# EasyEDA Pro project X-ROBOT主控板2.eprj

# Schematic Schematic1
Board Name: Board1; Create Date: 2024-06-28; Page Name: P1; Project Name: X-ROBOT主控板2; Schematic Name: Schematic1; Update Date: 2024-10-14
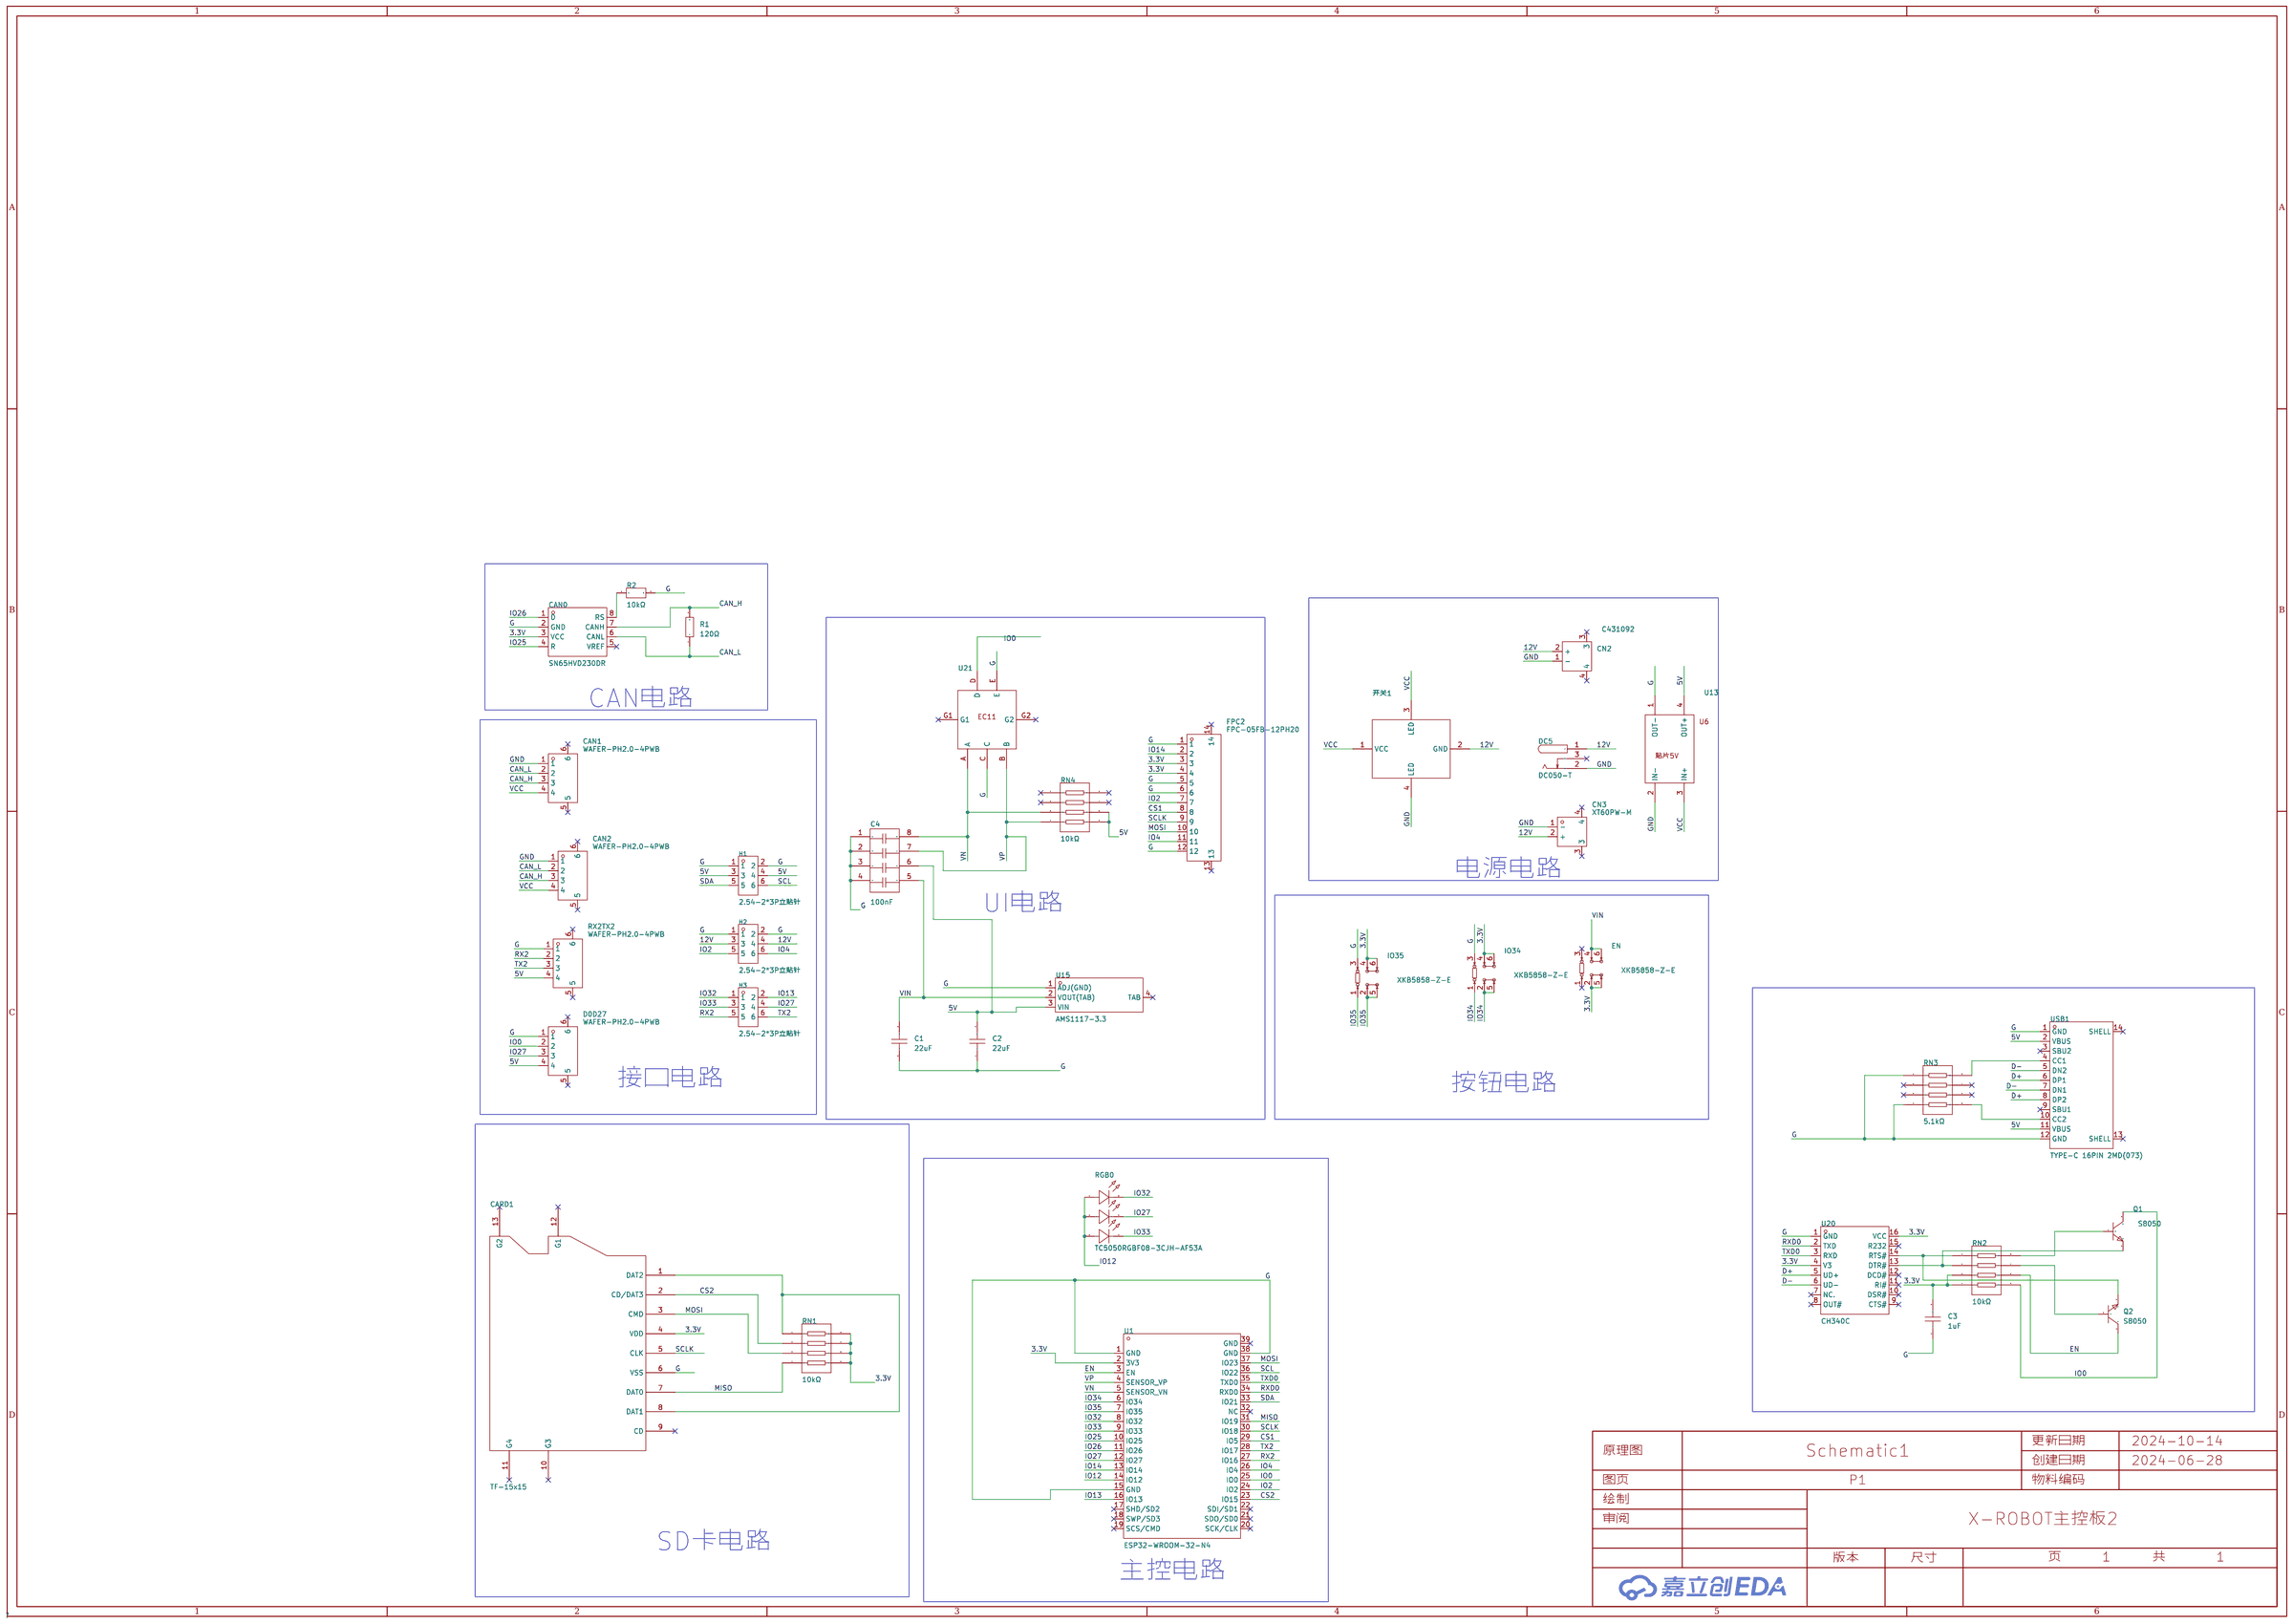
[diagram p0: schematic sheet]

## Parts
C1  22uF  [C0805]
C2  22uF  [C0805]
C3  1uF  [C0603]
C4  100nF  [CAP-ARRAY-SMD_6124-8P-L1.6-W3.2-BL]
CAN0  SN65HVD230DR  [SOIC-8_L4.9-W3.9-P1.27-LS6.0-BL]
CAN1  WAFER-PH2.0-4PWB  [CONN-SMD_4P-P2.00_XUNPU_WAFER-PH2.0-4PWB]
CAN2  WAFER-PH2.0-4PWB  [CONN-SMD_4P-P2.00_XUNPU_WAFER-PH2.0-4PWB]
CARD1  TF-15x15  [TF-SMD_TF-15-15]
CN2  C431092  [CONN-TH_XT30PW-M]
CN3  XT60PW-M  [CONN-TH_XT60PW-M]
D0D27  WAFER-PH2.0-4PWB  [CONN-SMD_4P-P2.00_XUNPU_WAFER-PH2.0-4PWB]
DC5  DC050-T  [DC-IN_DC050-T]
EN  XKB5858-Z-E  [SW-TH_XKB5858-Z-E]
FPC2  FPC-05FB-12PH20  [FPC-SMD_12P-P0.50_XUNPU_FPC-05FB-12PH20]
H1  2.54-2*3P立贴针  [HDR-SMD_6P-P2.54-V-M-R2-C5-S7.4]
H2  2.54-2*3P立贴针  [HDR-SMD_6P-P2.54-V-M-R2-C5-S7.4]
H3  2.54-2*3P立贴针  [HDR-SMD_6P-P2.54-V-M-R2-C5-S7.4]
IO34  XKB5858-Z-E  [SW-TH_XKB5858-Z-E]
IO35  XKB5858-Z-E  [SW-TH_XKB5858-Z-E]
Q1  S8050  [SOT-23-3_L2.9-W1.3-P1.90-LS2.3-BR]
Q2  S8050  [SOT-23-3_L2.9-W1.3-P1.90-LS2.3-BR]
R1  120Ω  [R0603]
R2  10kΩ  [R0603]
RGB0  TC5050RGBF08-3CJH-AF53A  [LED-SMD_6P-L5.0-W5.0-TL_TC5050RGBF08]
RN1  10kΩ  [RES-ARRAY-SMD_0603-8P-L3.2-W1.6-BL]
RN2  10kΩ  [RES-ARRAY-SMD_0603-8P-L3.2-W1.6-BL]
RN3  5.1kΩ  [RES-ARRAY-SMD_0603-8P-L3.2-W1.6-BL]
RN4  10kΩ  [RES-ARRAY-SMD_0603-8P-L3.2-W1.6-BL]
RX2TX2  WAFER-PH2.0-4PWB  [CONN-SMD_4P-P2.00_XUNPU_WAFER-PH2.0-4PWB]
U1  ESP32-WROOM-32-N4  [WIFIM-SMD_ESP32-WROOM-32-N4]
U13  -  [降压模块贴片]
U15  AMS1117-3.3  [SOT-223-4_L6.5-W3.5-P2.30-LS7.0-BR]
U20  CH340C  [SOP-16_L10.0-W3.9-P1.27-LS6.0-BL]
U21  -  [EC11-SMT]
USB1  TYPE-C 16PIN 2MD(073)  [USB-C-SMD_TYPE-C-6PIN-2MD-073]
开关1  -  [灯开关]

## Library data of the parts
C1 C2 = CGA0805X5R226M350MT: 容值:22uF;精度:±20%;额定电压:35V;材质(温度系数):X5R;; LCSC Part Name: 22uF ±20% 35V; Supplier Part: C6119901; Manufacturer: HRE(芯声); Supplier Footprint: 0805; JLCPCB Part Class: 扩展库; Datasheet: https://atta.szlcsc.com/upload/public/pdf/source/20231129/D589D0CC4D260F7AC3A77E53B455CCB3.pdf; Supplier: LCSC; Tolerance: ±20%; Voltage Rated: 35V; Temperature Coefficient: X5R
C3 = CL10A105KB8NNNC: 容值:1uF;精度:±10%;额定电压:50V;材质(温度系数):X5R;; LCSC Part Name: 1uF ±10% 50V; Supplier Part: C15849; Manufacturer: SAMSUNG(三星); Supplier Footprint: 0603; JLCPCB Part Class: 基础库; Datasheet: https://atta.szlcsc.com/upload/public/pdf/source/20160218/1457707763339.pdf; Supplier: LCSC; Tolerance: ±10%; Voltage Rated: 50V; Temperature Coefficient: X5R
C4 = 6124B104K500NT: 容值:100nF;精度:±10%;额定电压:50V;温度系数:X7R;电路形式:独立;; LCSC Part Name: 100nFX4 ±10% 50V; Supplier Part: C62857; Manufacturer: FH(风华); Supplier Footprint: 0612; JLCPCB Part Class: 扩展库; Datasheet: https://atta.szlcsc.com/upload/public/pdf/source/20230210/910F532CDA9A4E3A43AC22A06F0B1EDD.pdf; Supplier: LCSC; Tolerance: ±10%; Rated Voltage: 50V; Temperature Coefficient: X7R; Number of Capacitors: 4; Circuit Type: 独立
CAN0 = SN65HVD230DR: 类型:收发器;协议类别:CAN总线;数据速率:1Mbps;; Supplier Part: C12084; Manufacturer: TI(德州仪器); Supplier Footprint: SOIC-8_150mil; JLCPCB Part Class: Basic Part; Datasheet: https://atta.szlcsc.com/upload/public/pdf/source/20140508/1457707055452.pdf; Supplier: LCSC; Type: 收发器; Protocol: CAN总线; Data Rate: 1Mbps; Supply Voltage: 3V ~ 3.6V
CAN1 CAN2 D0D27 RX2TX2 = WAFER-PH2.0-4PWB: 插针结构:1x4P;间距:2mm;安装方式:卧贴;总PIN数:4P;排数:1;每排PIN数:4;额定电流:2A;工作温度范围:-25℃~+85℃;; LCSC Part Name: 1x4P 间距:2mm 卧贴; Supplier Part: C3029442; Manufacturer: XUNPU(讯普); Supplier Footprint: SMD,P=2mm,卧贴; JLCPCB Part Class: 扩展库; Datasheet: https://atta.szlcsc.com/upload/public/pdf/source/20220527/83903C18429EFE4C9EEE8C529A248431.pdf; Supplier: LCSC; Pins Structure: 1x4P; Pitch: 2mm; Mounting Style: 卧贴; Number of Pins: 4P; Number of Rows: 1; Number of PINs Per Row: 4; Current Rating (Max): 2A; Operating Temperature Range: -25℃~+85℃
CARD1 = TF-15x15: 卡连接方式:自弹式;卡类型:MicroSD卡(TF卡);连接器类型:卡座;本体最大高度:-;触头材质:-;触头镀层:-;工作温度范围:-;焊接温度(最大值):-;; LCSC Part Name: 自弹式 MicroSD卡(TF卡) 卡座; Supplier Part: C111196; Manufacturer: SOFNG(硕方); Supplier Footprint: SMD; JLCPCB Part Class: 扩展库; Datasheet: https://atta.szlcsc.com/upload/public/pdf/source/20200911/C111196_6985EA70490FD8F56A5C3F4D017F3786.pdf; Supplier: LCSC; Card Connection Mode: 自弹式; Card Type: MicroSD卡(TF卡); Connector Type: 卡座
CN2 = XT30PW-M: Socket,DCsupply,XT30,male,PIN:2; LCSC Part Name: XT30PW-M公头; Manufacturer: AMASS(艾迈斯); Supplier Footprint: Through Hole; JLCPCB Part Class: Extended Part; Datasheet: https://atta.szlcsc.com/upload/public/pdf/source/20220222/6A9F22F7850E25B33E1BE430ADF8560B.pdf; Supplier: LCSC
CN3 = XT60PW-M: 类别:-;类型1:-;; LCSC Part Name: AMASS(艾迈斯)航模插头xt60连接器150公母对接pw锂电池公头 板插卧式XT60PW-M; Supplier Part: C98732; Manufacturer: AMASS(艾迈斯); JLCPCB Part Class: 扩展库; Datasheet: https://atta.szlcsc.com/upload/public/pdf/source/20240118/44A3DCFF53BE25DC65378AFFB21277A4.pdf; Supplier: LCSC; Brand: 艾迈斯; Type: 卧式插头; Colour: 黄色; InterfaceType: 公头
DC5 = DC050-T: 连接器类型:DC电源插座;安装方式:卧贴;触点内径:2mm;触点外径:6.4mm;额定电流:4A;额定电压:16V;触头材质:-;触头镀层:-;工作温度范围:-;焊接温度(最大值):-;; LCSC Part Name: DC电源插座 内径:2mm 外径:6.4mm; Supplier Part: C431534; Manufacturer: SHOU HAN(首韩); Supplier Footprint: SMD; JLCPCB Part Class: 扩展库; Datasheet: https://atta.szlcsc.com/upload/public/pdf/source/20190925/C431534_67EA3B20454E00D5CD394807B04C56FF.pdf; Supplier: LCSC; Connector Type: DC电源插座; Mounting Style: 卧贴; Inside Contact Diameter: 2mm; Outside Contact Diameter: 6.4mm; Current Rating (Max): 4A; Voltage Rating (Max): 16V
EN IO34 IO35 = XKB5858-Z-E: 自锁/无锁:自锁;安装方式:卧插;触点电流:100mA;额定电压 (AC):250V;额定电压 (DC):30V;带灯:不带;作用力:2.5N;机械寿命:10万次;; Supplier Part: C780038; Manufacturer: XKB Connection(中国星坤); Supplier Footprint: 插件; JLCPCB Part Class: 扩展库; Datasheet: https://atta.szlcsc.com/upload/public/pdf/source/20211011/56D3FA9FC185EAC41365C3B37B684CC1.pdf; Supplier: LCSC; Self Lock / No Lock: 自锁; Actuator Style: 方形按钮; Mounting Style: 卧插; Contact Current: 100mA; Voltage Rating (AC): 250V; Voltage Rating (DC): 30V; Insulation Resistance: 100MΩ; Actuator/Cap Color: 白色; With Lamp: 不带; Pin Style: PC引脚; Operating Force: 2.5N; Operating Temperature: -15℃~+55℃; Mechanical Life: 10万次
FPC2 = FPC-05FB-12PH20: 锁定特性:翻盖式;触点类型:双侧触点/上下接;触点数量:12P;间距:0.5mm;安装类型:卧贴;工作温度范围:-25℃~+85℃;; LCSC Part Name: 间距:0.5mm P数:12P 翻盖式 双侧触点/上下接; Supplier Part: C2856829; Manufacturer: XUNPU(讯普); Supplier Footprint: SMD,P=0.5mm,卧贴; JLCPCB Part Class: 扩展库; Datasheet: https://atta.szlcsc.com/upload/public/pdf/source/20210922/C2856829_1461FF4D7B8CBFF1BCF0CE5DE3B804A8.pdf; Supplier: LCSC; Locking Feature: 翻盖式; Contact Type: 双侧触点/上下接; Number of Contacts: 12P; Pitch: 0.5mm; Mounting Type: 卧贴; FFC, FCB Thickness: 0.3mm; Height Above Board: 2mm; Operating Temperature Range: -25℃~+85℃
H1-H3 = 2.54-2*3P立贴针: 插针结构:-;间距:2.54mm;行距:-;圆针/方针:-;安装类型:-;排数:双排;总PIN位数:6P;额定电流:-;额定电压:-;配合针长度:-;塑高:-;触头材质:-;触头镀层:-;颜色:黑色;; LCSC Part Name: 间距:2.54mm; Supplier Part: C192301; Manufacturer: BOOMELE(博穆精密); Supplier Footprint: SMD,P=2.54mm,卧贴; JLCPCB Part Class: 扩展库; Supplier: LCSC; Pitch: 2.54mm; Number of Rows: 双排; Number of Pins: 6P; Color: 黑色
Q1 Q2 = S8050_C20069125: 晶体管类型:NPN;集电极电流(Ic):500mA;集射极击穿电压(Vceo):25V;功率(Pd):300mW;直流电流增益(hFE@Ic,Vce):120@50mA,1.0V;; LCSC Part Name: NPN 电流:500mA 耐压:25V; Supplier Part: C20069125; Manufacturer: 宏迦橙; Supplier Footprint: SOT-23; JLCPCB Part Class: 扩展库; Datasheet: https://atta.szlcsc.com/upload/public/pdf/source/20240403/2D78449C96B6E27F13BF8BDF79E27159.pdf; Supplier: LCSC; Transistor Type: NPN; Collector Current (Ic): 500mA; Collector-Emitter Breakdown Voltage (Vceo): 25V; Power Dissipation (Pd): 300mW; DC Current Gain (hFE@Ic,Vce): 120@50mA,1.0V; Transition Frequency (fT): 100MHz; Collector Cut-Off Current (Icbo): 100nA; Collector-Emitter Saturation Voltage (VCE(sat)@Ic,Ib): 600mV@500mA,50mA; Operating Temperature: -55℃~+150℃
R1 = 0603WAF1200T5E: 电阻类型:厚膜电阻;阻值:120Ω;精度:±1%;功率:100mW;最大工作电压:75V;温度系数:±100ppm/℃;; LCSC Part Name: 120Ω ±1% 100mW 厚膜电阻; Supplier Part: C22787; Manufacturer: UNI-ROYAL(厚声); Supplier Footprint: 0603; JLCPCB Part Class: 基础库; Datasheet: https://atta.szlcsc.com/upload/public/pdf/source/20200306/C422600_1E6D84923E4A46A82E41ADD87F860B5C.pdf; Supplier: LCSC; Type: 厚膜电阻; Tolerance: ±1%; Power(Watts): 100mW; Overload Voltage (Max): 75V; Temperature Coefficient: ±100ppm/℃; Operating Temperature Range: -55℃~+155℃
R2 = FRC0603J103TS: 电阻类型:厚膜电阻;阻值:10kΩ;精度:±5%;功率:100mW;最大工作电压:75V;温度系数:±100ppm/℃;; LCSC Part Name: 10kΩ ±5% 100mW 厚膜电阻; Supplier Part: C2930027; Manufacturer: FOJAN(富捷); Supplier Footprint: 0603; JLCPCB Part Class: 扩展库; Datasheet: https://atta.szlcsc.com/upload/public/pdf/source/20211221/925EC7D7225764EE0046F22065062C87.pdf; Supplier: LCSC; Type: 厚膜电阻; Tolerance: ±5%; Power(Watts): 100mW; Overload Voltage (Max): 75V; Temperature Coefficient: ±100ppm/℃; Operating Temperature Range: -55℃~+155℃
RGB0 = TC5050RGBF08-3CJH-AF53A: LED贴片5050RGB灯珠高亮红绿蓝三色0.2W; LCSC Part Name: RGB三色; Supplier Part: C784540; Manufacturer: TCWIN(天成); Supplier Footprint: SMD5050; JLCPCB Part Class: 扩展库; Datasheet: https://atta.szlcsc.com/upload/public/pdf/source/20230731/34B1F7048EB892D234C2083EEE9FB085.pdf; Supplier: LCSC
RN1 RN2 RN4 = 4D03WGJ0103T5E: 电阻器数:4;阻值:10kΩ;精度:±5%;单个元件功率:62.5mW;温度系数:±200ppm/℃;; LCSC Part Name: 10kΩ ±5%; Supplier Part: C29718; Manufacturer: UNI-ROYAL(厚声); Supplier Footprint: 0603x4; JLCPCB Part Class: 基础库; Datasheet: https://atta.szlcsc.com/upload/public/pdf/source/20191224/C474318_2527498AE30E813171187CCD28401A71.pdf; Supplier: LCSC; Number of Resistors: 4; Tolerance: ±5%; Power(Watts): 62.5mW; Temperature Coefficient: ±200ppm/℃; Number of Pins: 8
RN3 = 4D03WGJ0512T5E: 电阻器数:4;阻值:5.1kΩ;精度:±5%;单个元件功率:62.5mW;温度系数:±200ppm/℃;; LCSC Part Name: 5.1kΩ ±5% 0603x4; Supplier Part: C12028; Manufacturer: UNI-ROYAL(厚声); Supplier Footprint: 0603x4; JLCPCB Part Class: 扩展库; Datasheet: https://atta.szlcsc.com/upload/public/pdf/source/20191224/C474318_2527498AE30E813171187CCD28401A71.pdf; Supplier: LCSC; Number of Resistors: 4; Tolerance: ±5%; Power(Watts): 62.5mW; Temperature Coefficient: ±200ppm/℃; Number of Pins: 8
U1 = ESP32-WROOM-32-N4: WiFi+蓝牙4.2+双核CPU,ESP32; LCSC Part Name: WiFi+蓝牙4.2+双核CPU模块; Supplier Part: C82899; Manufacturer: ESPRESSIF(乐鑫); Supplier Footprint: SMD,18x25.5mm; JLCPCB Part Class: 扩展库; Datasheet: https://atta.szlcsc.com/upload/public/pdf/source/20210719/C82899_2D52724B6FAFABC419BCF308C5944296.pdf; Supplier: LCSC
U13 = 降压模块贴片
U15 = AMS1117-3.3_C347222: 输出类型:固定;最大输入电压:12V;输出电压:3.3V;最大输出电流:1A;电源纹波抑制比(PSRR):60dB@(120Hz);输出极性:正极;; LCSC Part Name: 输出:3.3V 电流:1A 耐压:12V; Supplier Part: C347222; Manufacturer: UMW(友台半导体); Supplier Footprint: SOT-223; JLCPCB Part Class: 扩展库; Datasheet: https://atta.szlcsc.com/upload/public/pdf/source/20231109/155D79A26D9DB04352555A58D5969DC8.pdf; Supplier: LCSC; Output Type: 固定; Maximum Input Voltage: 12V; Output Voltage: 3.3V; MAX Output Current: 1A; Power Supply Rejection Ratio (PSRR): 60dB@(120Hz); Dropout Voltage: 1.3V@(1A); Output Polarity: 正极; Number of Outputs: 1
U20 = CH340C_C7464026: LCSC Part Name: CH340C （SMT编带）人工转编带; Supplier Part: C7464026; Manufacturer: WCH(南京沁恒); Supplier Footprint: SOP-16; JLCPCB Part Class: 扩展库; Datasheet: https://atta.szlcsc.com/upload/public/pdf/source/20230530/6E401E9554E9F5311886CC8B3F89B62E.pdf; Supplier: LCSC
U21 = EC11-SMT
USB1 = TYPE-C 16PIN 2MD(073): 连接器类型:Type-C;标准:-;公母:母;端口数量:1;触点数量:16P;安装方式:卧贴;额定电流 - 电源:5A;工作温度范围:-25℃~+85℃;; LCSC Part Name: Type-C 母 卧贴; Supplier Part: C2765186; Manufacturer: SHOU HAN(首韩); Supplier Footprint: SMD; JLCPCB Part Class: 扩展库; Datasheet: https://atta.szlcsc.com/upload/public/pdf/source/20211123/39B17C16241EAC15C5E277BDA434118E.pdf; Supplier: LCSC; Connector Type: Type-C; Gender: 母; Number of Ports: 1; Number of Contacts: 16P; Mounting Style: 卧贴; Current Rating - Power (Max): 5A; Operating Temperature Range: -25℃~+85℃
开关1 = 灯开关

## Nets
3.3V: C3.2 CAN0.3(VCC) CARD1.4(VDD) EN.2 EN.5 FPC2.3 FPC2.4 IO34.4 IO34.6 IO35.4 IO35.6 RN1.5 RN1.6 RN1.7 RN1.8 RN2.3 RN2.4 U1.2(3V3) U20.4(V3) U20.16(VCC)
5V: C2.2 C4.6 D0D27.4 H1.3 H1.4 RN4.5 RN4.6 RX2TX2.4 U13.4(OUT+) U15.3(VIN) USB1.2(VBUS) USB1.11(VBUS)
12V: CN2.2(+) CN3.2(+) DC5.1 H2.3 H2.4 开关1.2(GND)
GND: CAN1.1 CAN2.1 CN2.1(-) CN3.1(-) DC5.2 U13.2(IN-) 开关1.4(LED)
VCC: CAN1.4 CAN2.4 U13.3(IN+) 开关1.1(VCC) 开关1.3(LED)
VIN: C1.2 C4.5 EN.4 EN.6 U15.2(VOUT(TAB))
CAN_H: CAN0.7(CANH) CAN1.3 CAN2.3 R1.2
CAN_L: CAN0.6(CANL) CAN1.2 CAN2.2 R1.1
CS1: FPC2.8 U1.29(IO5)
CS2: CARD1.2(CD/DAT3) RN1.2 U1.23(IO15)
D+: U20.5(UD+) USB1.6(DP1) USB1.8(DP2)
D-: U20.6(UD-) USB1.5(DN2) USB1.7(DN1)
EN: Q2.3(C) RN2.6 U1.3(EN)
G: C1.1 C2.1 C3.1 C4.1 C4.2 C4.3 C4.4 CAN0.2(GND) CARD1.6(VSS) D0D27.1 FPC2.1 FPC2.5 FPC2.6 FPC2.12 H1.1 H1.2 H2.1 H2.2 IO34.3 IO35.3 R2.2 RN3.1 RN3.4 RX2TX2.1 U1.1(GND) U1.15(GND) U1.38(GND) U13.1(OUT-) U15.1(ADJ(GND)) U20.1(GND) U21.C U21.E USB1.1(GND) USB1.12(GND)
IO0: D0D27.2 Q1.3(C) RN2.5 U1.25(IO0) U21.D
IO2: FPC2.7 H2.5 U1.24(IO2)
IO4: FPC2.11 H2.6 U1.26(IO4)
IO12: RGB0.1(+) RGB0.2(+) RGB0.3(+) U1.14(IO12)
IO13: H3.2 U1.16(IO13)
IO14: FPC2.2 U1.13(IO14)
IO25: CAN0.4(R) U1.10(IO25)
IO26: CAN0.1(D) U1.11(IO26)
IO27: D0D27.3 H3.4 RGB0.5(-) U1.12(IO27)
IO32: H3.1 RGB0.6(-) U1.8(IO32)
IO33: H3.3 RGB0.4(-) U1.9(IO33)
IO34: IO34.1 IO34.2 IO34.5 U1.6(IO34)
IO35: IO35.1 IO35.2 IO35.5 U1.7(IO35)
MISO: CARD1.7(DAT0) RN1.4 U1.31(IO19)
MOSI: CARD1.3(CMD) FPC2.10 RN1.3 U1.37(IO23)
RX2: H3.5 RX2TX2.2 U1.27(IO16)
RXD0: U1.34(RXD0) U20.2(TXD)
SCL: H1.6 U1.36(IO22)
SCLK: CARD1.5(CLK) FPC2.9 U1.30(IO18)
SDA: H1.5 U1.33(IO21)
TX2: H3.6 RX2TX2.3 U1.28(IO17)
TXD0: U1.35(TXD0) U20.3(RXD)
VN: C4.8 RN4.3 U1.5(SENSOR_VN) U21.A
VP: C4.7 RN4.4 U1.4(SENSOR_VP) U21.B
$1N183: CARD1.1(DAT2) CARD1.8(DAT1) RN1.1
$1N4998: Q1.2(E) RN2.2 U20.13(DTR#)
$1N5002: Q2.1(B) RN2.7
$1N5022: Q2.2(E) RN2.1 U20.14(RTS#)
$1N5027: Q1.1(B) RN2.8
$1N5307: RN3.5 USB1.10(CC2)
$1N5334: RN3.8 USB1.4(CC1)
$1N9575: CAN0.8(RS) R2.1

Not connected (* = marked no-connect by the designer): CAN0 5(VREF)*; CAN1 5* 6*; CAN2 5* 6*; CARD1 9(CD)* 10(G3)* 11(G4)* 12(G1)* 13(G2)*; CN2 3* 4*; CN3 3* 4*; D0D27 5* 6*; DC5 3*; EN 1* 3*; FPC2 13* 14*; RN3 2* 3* 6* 7*; RN4 1* 2* 7* 8*; RX2TX2 5* 6*; U1 17(SHD/SD2)* 18(SWP/SD3)* 19(SCS/CMD)* 20(SCK/CLK)* 21(SDO/SD0)* 22(SDI/SD1)* 32(NC)* 39(GND)*; U15 4(TAB)*; U20 7(NC.)* 8(OUT#)* 9(CTS#)* 10(DSR#)* 11(RI#)* 12(DCD#)* 15(R232)*; U21 G1* G2*; USB1 3(SBU2)* 9(SBU1)* 13(SHELL)* 14(SHELL)*

## Notes on the sheet
- CAN电路
- 电源电路
- UI电路
- 接口电路
- 按钮电路
- SD卡电路
- 主控电路

# Board PCB1
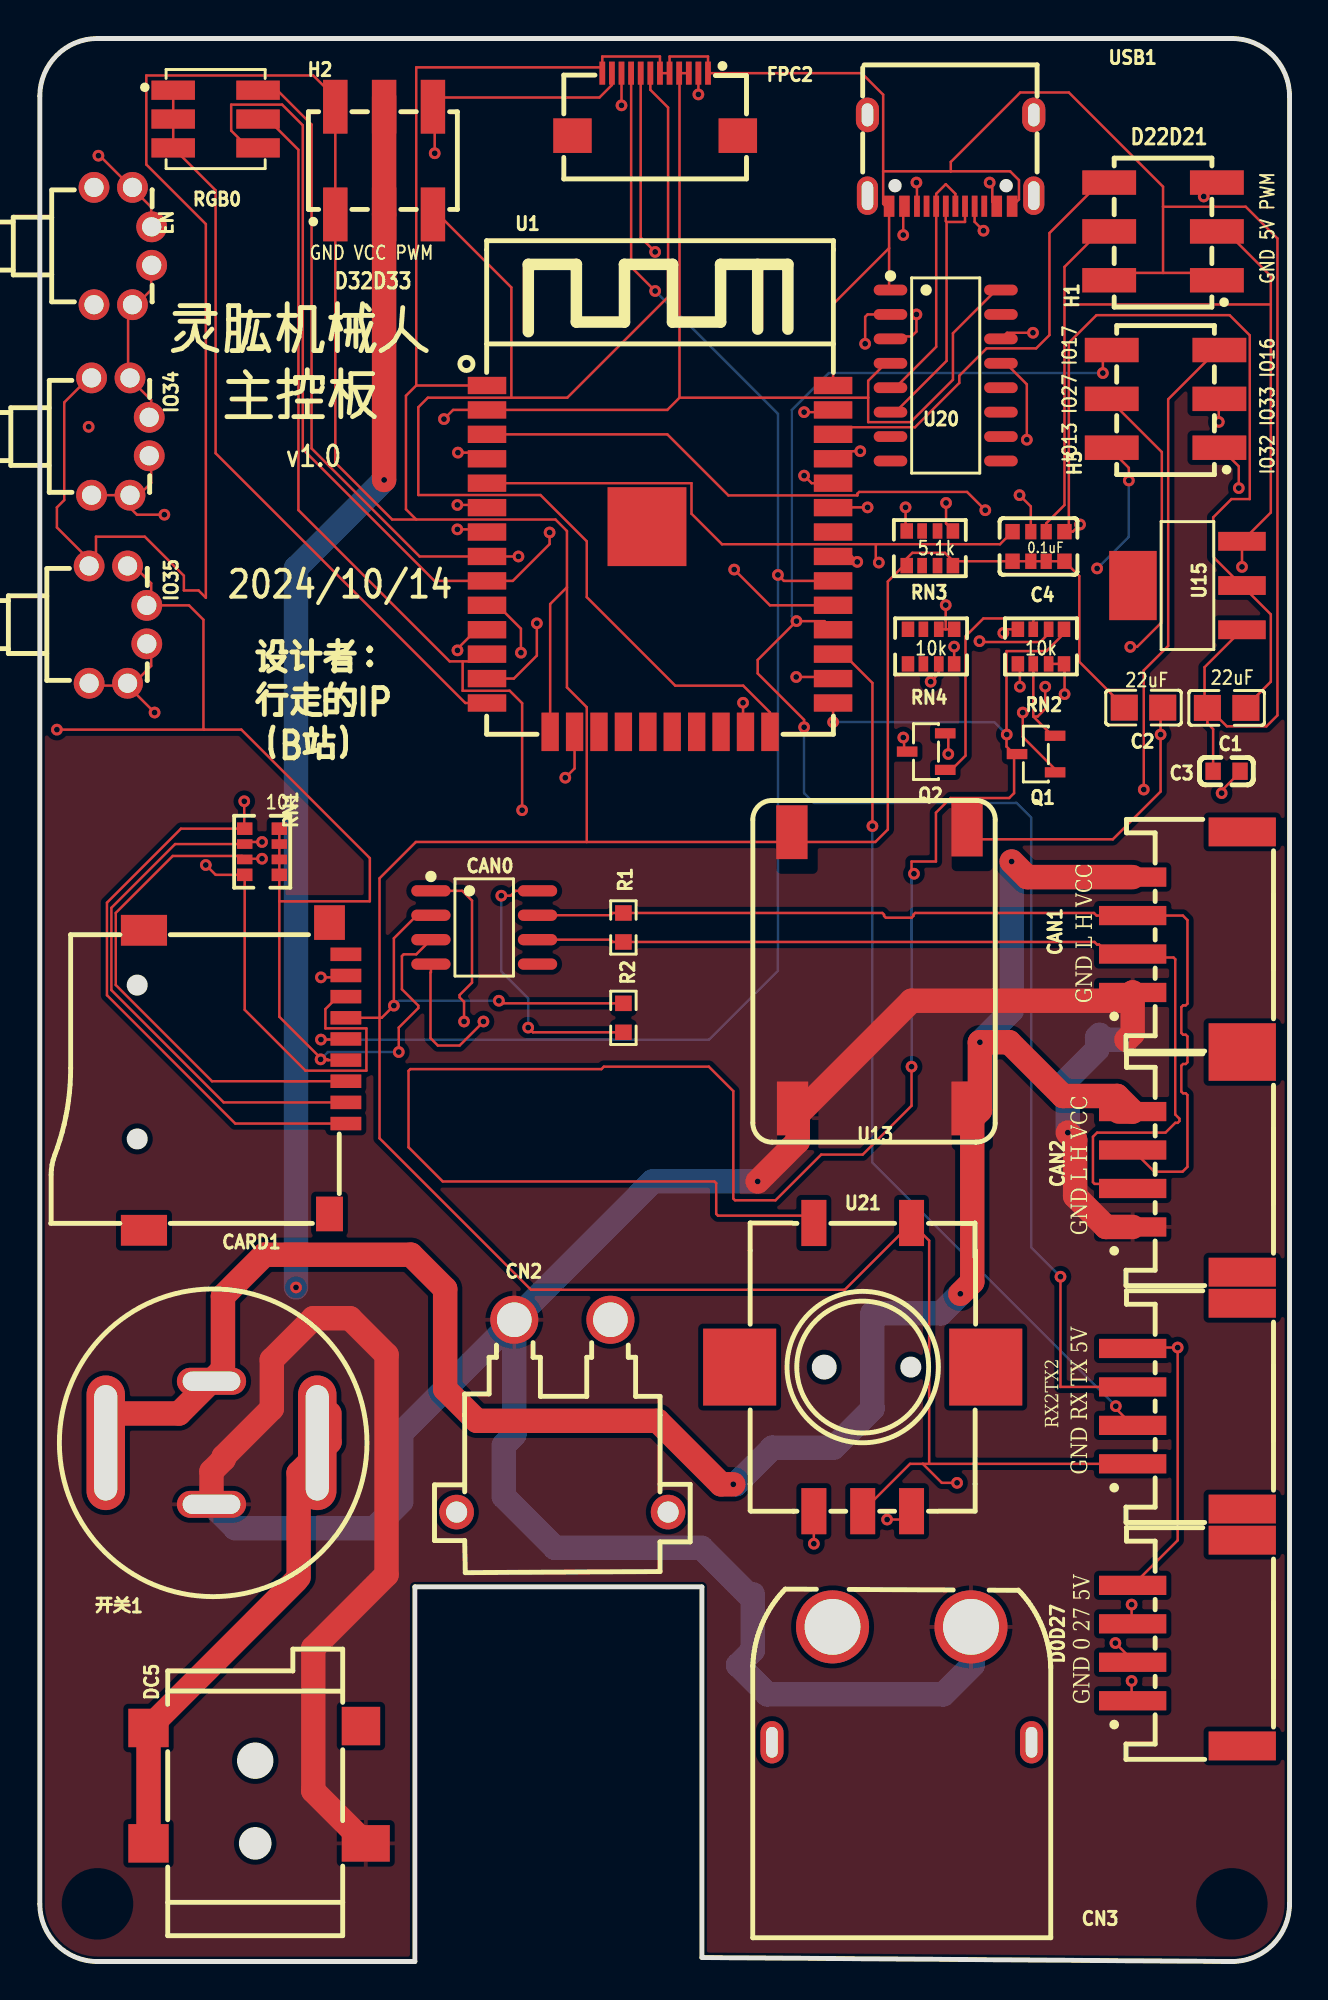
[diagram p1: board, top side]
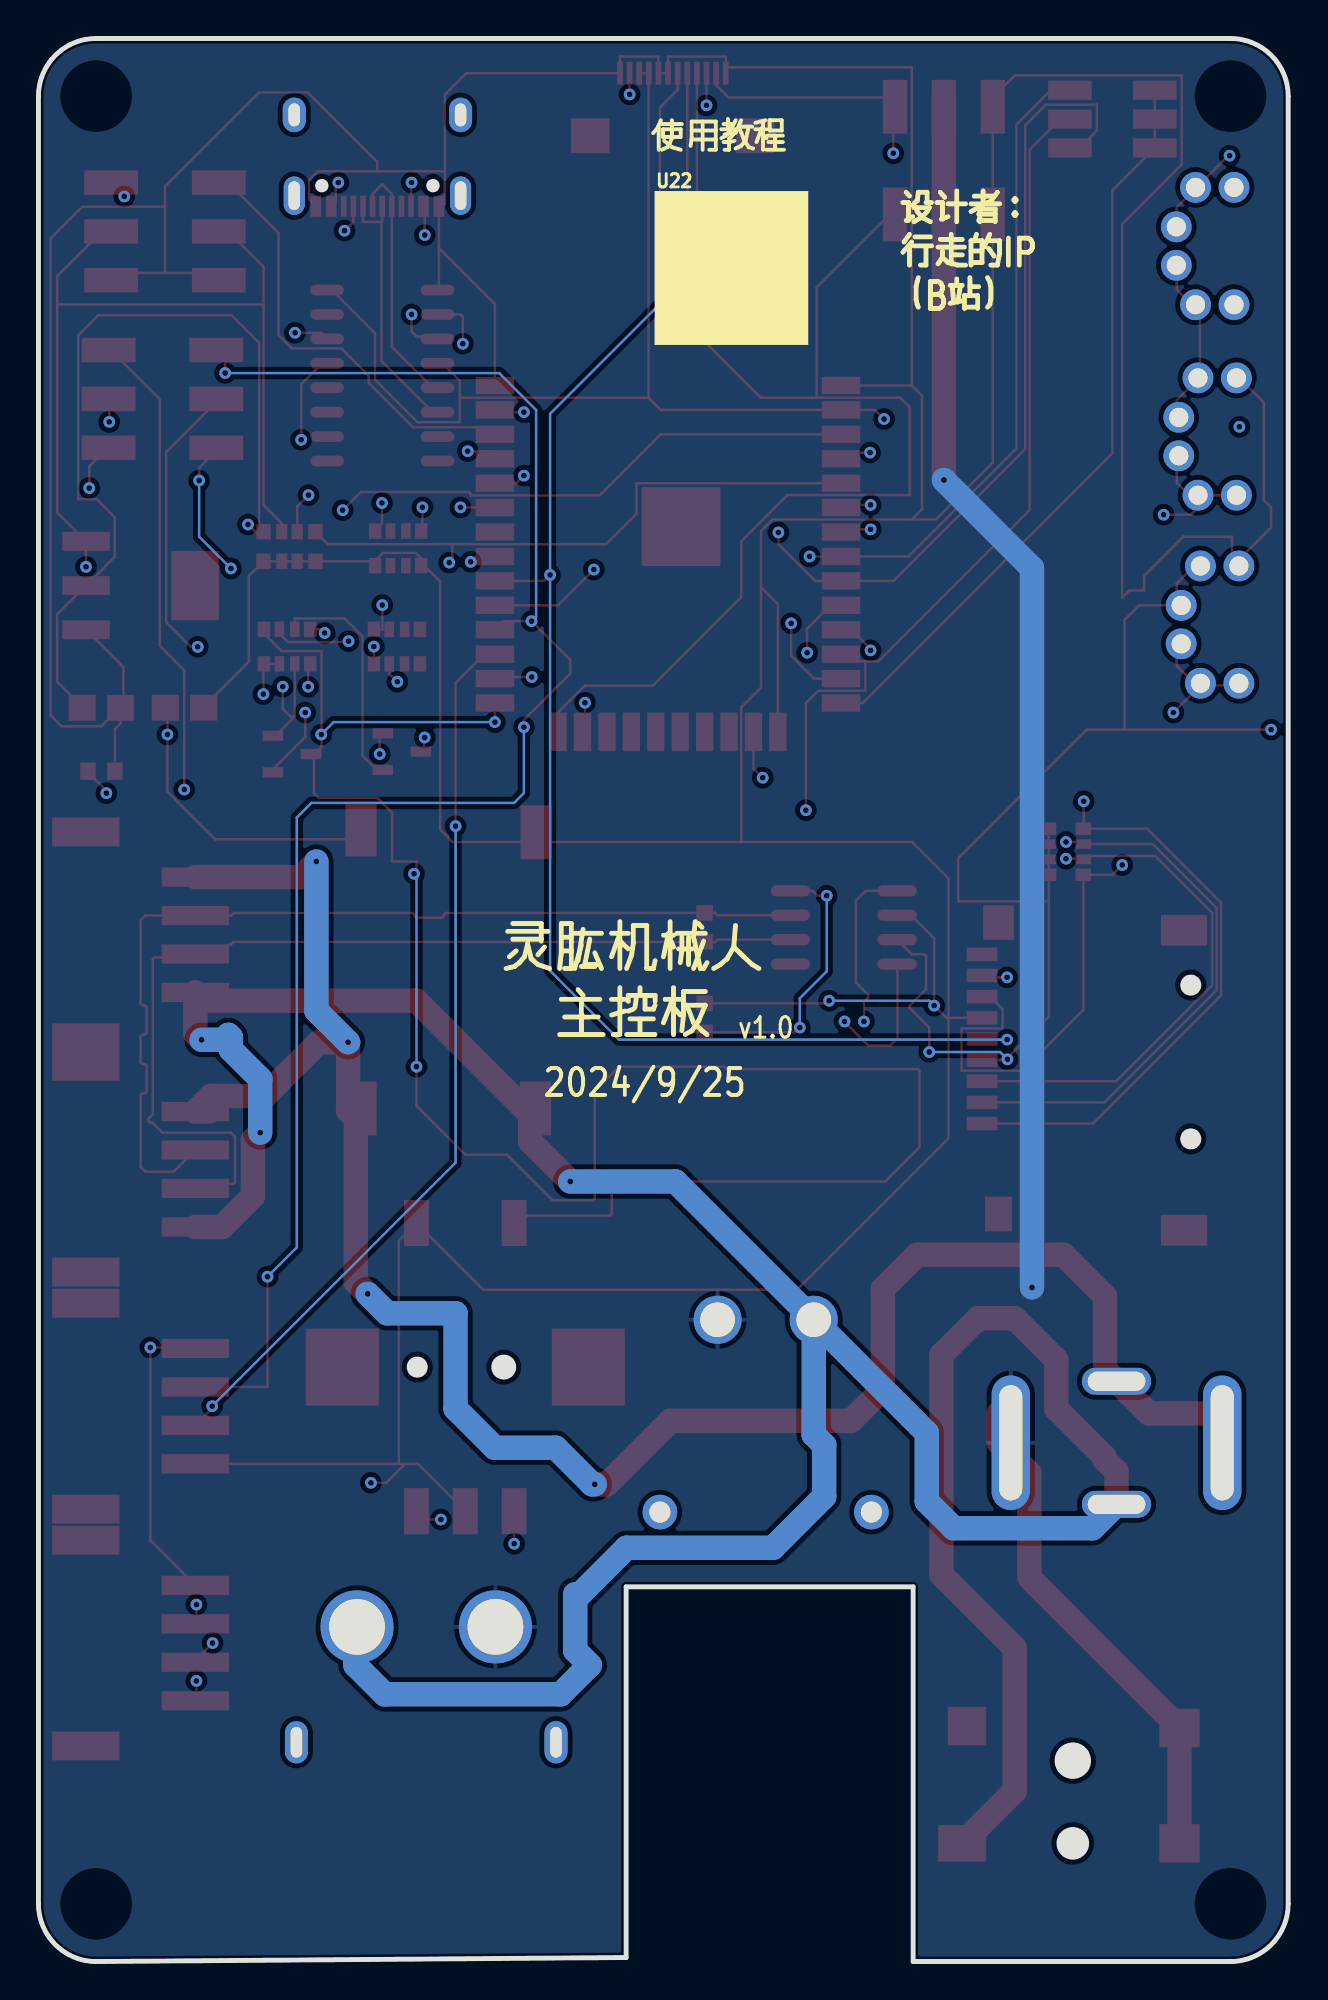
[diagram p2: board, bottom side, seen from below]

Outline 65 x 100 mm; copper layers: Top Layer, Inner1, Inner2, Bottom Layer. Coordinates in mm from the lower left corner of the outline.
Outline path: 0,97 0,3 arc(0.88,0.88) 3,0 19.51,0 19.51,19.48 34.44,19.48 34.44,0.21 62,0 arc(64.12,0.88) 65,3 65,97 arc(64.12,99.12) 62,100 3,100 arc(0.88,99.12) 0,97
Stack: Top Layer 0.035mm 外层铜厚1oz / Dielectric1 0.2104mm 7628 RC49% 8.6mil / Inner1 0.0152mm 内层铜厚 / Dielectric2 1.065mm 1.1mm H/HOZ 含铜 / Inner2 0.0152mm 内层铜厚 / Dielectric3 0.2104mm 7628 RC49% 8.6mil / Bottom Layer 0.035mm 外层铜厚1oz

## Design rules (mm)
net CAN_H: DP1
net CAN_L: DP1
template: 自定义配置
spacing copperThickness1oz (default): track to track 0.102, other pairs 0.076 to 0.3
spacing copperThickness2oz: track to track 0.203, other pairs 0.152 to 0.3
track width copperThickness1oz (default): min 0.127, default 0.127, max 2.54
track width copperThickness2oz: min 0.508, default 0.508, max 2.54
track width trackWidth1: min 1.27, default 1.27, max 2.54
differential pair differentialPair (default): width min 0.127, default 0.254, max 2.54; gap min 0.152, default 0.152
via viaSize (default): diameter min 0.5, default 0.61, max 10; hole min 0.3, default 0.305, max 6.299
net GND uses copperThickness2oz
net VCC uses trackWidth1
net 12V uses trackWidth1

## Placement (name value [footprint] x y rotation side)
C1  22uF  [C0805]  61.73 65.19 0 top
C2  22uF  [C0805]  57.4 65.2 0 top
C3  1uF  [C0603]  61.72 61.9 0 top
C4  100nF  [CAP-ARRAY-SMD_6124-8P-L1.6-W3.2-BL]  51.94 73.58 0 top
CAN0  SN65HVD230DR  [SOIC-8_L4.9-W3.9-P1.27-LS6.0-BL]  23.11 53.77 270 top
CAN1  WAFER-PH2.0-4PWB  [CONN-SMD_4P-P2.00_XUNPU_WAFER-PH2.0-4PWB]  59.69 53.39 90 top
CAN2  WAFER-PH2.0-4PWB  [CONN-SMD_4P-P2.00_XUNPU_WAFER-PH2.0-4PWB]  59.69 41.2 90 top
CARD1  TF-15x15  [TF-SMD_TF-15-15]  10.67 46.03 180 top
CN2  C431092  [CONN-TH_XT30PW-M]  27.18 28.37 0 top
CN3  XT60PW-M  [CONN-TH_XT60PW-M]  44.83 14.4 90 top
D0D27  WAFER-PH2.0-4PWB  [CONN-SMD_4P-P2.00_XUNPU_WAFER-PH2.0-4PWB]  59.69 16.56 90 top
DC5  DC050-T  [DC-IN_DC050-T]  11.3 9.19 90 top
EN  XKB5858-Z-E  [SW-TH_XKB5858-Z-E]  4.32 89.2 90 top
FPC2  FPC-05FB-12PH20  [FPC-SMD_12P-P0.50_XUNPU_FPC-05FB-12PH20]  32 96.57 0 top
H1  2.54-2*3P立贴针  [HDR-SMD_6P-P2.54-V-M-R2-C5-S7.4]  58.42 89.97 90 top
H2  2.54-2*3P立贴针  [HDR-SMD_6P-P2.54-V-M-R2-C5-S7.4]  17.91 93.65 0 top
H3  2.54-2*3P立贴针  [HDR-SMD_6P-P2.54-V-M-R2-C5-S7.4]  58.55 81.26 90 top
IO34  XKB5858-Z-E  [SW-TH_XKB5858-Z-E]  4.19 79.3 90 top
IO35  XKB5858-Z-E  [SW-TH_XKB5858-Z-E]  4.06 69.52 90 top
Q1  S8050  [SOT-23-3_L2.9-W1.3-P1.90-LS2.3-BR]  51.82 62.79 0 top
Q2  S8050  [SOT-23-3_L2.9-W1.3-P1.90-LS2.3-BR]  46.1 62.92 0 top
R1  120Ω  [R0603]  30.35 53.77 90 top
R2  10kΩ  [R0603]  30.35 49.07 90 top
RGB0  TC5050RGBF08-3CJH-AF53A  [LED-SMD_6P-L5.0-W5.0-TL_TC5050RGBF08]  9.14 95.81 0 top
RN1  10kΩ  [RES-ARRAY-SMD_0603-8P-L3.2-W1.6-BL]  11.56 57.71 270 top
RN2  10kΩ  [RES-ARRAY-SMD_0603-8P-L3.2-W1.6-BL]  52.07 68.38 0 top
RN3  5.1kΩ  [RES-ARRAY-SMD_0603-8P-L3.2-W1.6-BL]  46.29 73.49 0 top
RN4  10kΩ  [RES-ARRAY-SMD_0603-8P-L3.2-W1.6-BL]  46.35 68.38 0 top
RX2TX2  WAFER-PH2.0-4PWB  [CONN-SMD_4P-P2.00_XUNPU_WAFER-PH2.0-4PWB]  59.69 28.88 90 top
U1  ESP32-WROOM-32-N4  [WIFIM-SMD_ESP32-WROOM-32-N4]  32.26 72.95 0 top
U13  -  [降压模块贴片]  43.94 51.11 0 top
U15  AMS1117-3.3  [SOT-223-4_L6.5-W3.5-P2.30-LS7.0-BR]  59.69 71.55 0 top
U20  CH340C  [SOP-16_L10.0-W3.9-P1.27-LS6.0-BL]  47.12 82.47 270 top
U21  -  [EC11-SMT]  42.8 30.91 0 top
U22  -  [JLC-QRCODE-8x8]  28.96 88.06 180 bottom
USB1  TYPE-C 16PIN 2MD(073)  [USB-C-SMD_TYPE-C-6PIN-2MD-073]  47.37 93.65 180 top
开关1  -  [灯开关]  3.43 26.97 0 top

## Footprints (pads in the part's own frame, mm; a bottom-side part is the same pattern mirrored in y, then rotated)
C0603
  rect 0.8x0.9 smd: 1(-0.7,0) 2(0.7,0)
C0805
  rect 1.41x1.35 smd: 1(-1,0) 2(1,0)
CAP-ARRAY-SMD_6124-8P-L1.6-W3.2-BL
  rect 0.75x0.8 smd: 1(-1.35,-0.77) 4(1.35,-0.77) 5(1.35,0.77) 8(-1.35,0.77)
  rect 0.58x0.8 smd: 2(-0.4,-0.77) 3(0.4,-0.77) 6(0.4,0.77) 7(-0.4,0.77)
CONN-SMD_4P-P2.00_XUNPU_WAFER-PH2.0-4PWB
  rect 1x3.5 smd: 1(-3,2.85) 2(-1,2.85) 3(1,2.85) 4(3,2.85)
  rect 1.5x3.5 smd: 5(5.35,-2.85) 6(-5.35,-2.85)
CONN-TH_XT30PW-M
  round 2.5 hole 1.8: 1(-2.5,5) 2(2.5,5)
  round 1.8 hole 1.1: 3(5.5,-5) 4(-5.5,-5)
CONN-TH_XT60PW-M
  round 3.8 hole 2.9: 1(3,-3.6) 2(3,3.6)
  oval 2.2x1.2 hole 1.6x0.6: 3(-3,6.75) 4(-3,-6.75)
DC-IN_DC050-T
  rect 2x2.1 smd: 1(-3.05,5.65) 1(2.95,5.65)
  rect 1.9x2.5 smd: 2(-3.05,-5.65)
  rect 2x2 smd: 3(3.05,-5.4)
EC11-SMT
  rect 1.3x2.4 smd: A(-2.54,-7.493) B(2.54,-7.493) C(0,-7.493) D(-2.54,7.493) E(2.54,7.493)
  rect 3.8x4 smd: G1(-6.4,0) G2(6.4,0)
FPC-SMD_12P-P0.50_XUNPU_FPC-05FB-12PH20
  rect 0.3x1.2 smd: 1(2.75,1.625) 2(2.25,1.625) 3(1.75,1.625) 4(1.25,1.625) 5(0.75,1.625) 6(0.25,1.625) 7(-0.25,1.625) 8(-0.75,1.625) 9(-1.25,1.625) 10(-1.75,1.625) 11(-2.25,1.625) 12(-2.75,1.625)
  rect 2x1.8 smd: 13(-4.3,-1.625) 14(4.3,-1.625)
HDR-SMD_6P-P2.54-V-M-R2-C5-S7.4
  rect 1.27x2.8 smd: 1(-2.54,-2.8) 2(-2.54,2.8) 3(0,-2.8) 4(0,2.8) 5(2.54,-2.8) 6(2.54,2.8)
LED-SMD_6P-L5.0-W5.0-TL_TC5050RGBF08
  rect 2.265x1 smd: 1(-2.208,1.5) 2(-2.208,0) 3(-2.208,-1.5) 4(2.208,-1.5) 5(2.208,0) 6(2.208,1.5)
R0603
  rect 0.806x0.864 smd: 1(-0.753,0) 2(0.753,0)
RES-ARRAY-SMD_0603-8P-L3.2-W1.6-BL
  rect 0.65x0.8 smd: 1(-1.2,-0.9) 4(1.2,-0.9) 5(1.2,0.9) 8(-1.2,0.9)
  rect 0.5x0.8 smd: 2(-0.4,-0.9) 3(0.4,-0.9) 6(0.4,0.9) 7(-0.4,0.9)
SOIC-8_L4.9-W3.9-P1.27-LS6.0-BL
  oval 0.588x2.045 smd: 1(-1.905,-2.772) 2(-0.635,-2.772) 3(0.635,-2.772) 4(1.905,-2.772) 5(1.905,2.772) 6(0.635,2.772) 7(-0.635,2.772) 8(-1.905,2.772)
SOP-16_L10.0-W3.9-P1.27-LS6.0-BL
  oval 0.56x1.745 smd: 1(-4.445,-2.873) 2(-3.175,-2.873) 3(-1.905,-2.873) 4(-0.635,-2.873) 5(0.635,-2.873) 6(1.905,-2.873) 7(3.175,-2.873) 8(4.445,-2.873) 9(4.445,2.873) 10(3.175,2.873) 11(1.905,2.873) 12(0.635,2.873) 13(-0.635,2.873) 14(-1.905,2.873) 15(-3.175,2.873) 16(-4.445,2.873)
SOT-23-3_L2.9-W1.3-P1.90-LS2.3-BR
  rect 1.07x0.532 smd: 1(0.99,-0.95) 2(0.99,0.95) 3(-0.99,0)
SOT-223-4_L6.5-W3.5-P2.30-LS7.0-BR
  rect 2.47x0.98 smd: 1(2.835,-2.3) 2(2.835,0) 3(2.835,2.3)
  rect 2.47x3.6 smd: 4(-2.835,0)
SW-TH_XKB5858-Z-E
  round 1.6 hole 1: 1(-3.05,1.5) 2(-3.05,-0.5) 3(3.05,1.5) 4(3.05,-0.5) 5(-1,-1.5) 6(1,-1.5)
TF-SMD_TF-15-15
  rect 1.6x0.701 smd: 1(-5.252,2.45) 2(-5.252,1.35) 3(-5.252,0.25) 4(-5.252,-0.85) 5(-5.252,-1.95) 6(-5.252,-3.05) 7(-5.252,-4.15) 8(-5.252,-5.25) 9(-5.252,-6.35)
  rect 1.6x1.8 smd: 10(-4.399,-8)
  rect 2.4x1.6 smd: 11(5.252,-7.6) 12(5.252,8)
  rect 1.399x1.801 smd: 13(-4.398,7.151)
USB-C-SMD_TYPE-C-6PIN-2MD-073
  rect 0.55x1.1 smd: 1(-3.2,2.375) 2(-2.4,2.375) 11(2.4,2.375) 12(3.2,2.375)
  rect 0.3x1.1 smd: 3(-1.75,2.375) 4(-1.25,2.375) 5(-0.75,2.375) 6(-0.25,2.375) 7(0.25,2.375) 8(0.75,2.375) 9(1.25,2.375) 10(1.75,2.375)
  oval 1.1x2 hole 0.6x1.5: 13(-4.325,1.825) 14(4.325,1.825)
  oval 1.2x1.8 hole 0.6x1.2: 13(-4.325,-2.375) 14(4.325,-2.375)
WIFIM-SMD_ESP32-WROOM-32-N4
  rect 2x0.9 smd: 1(-9,9.005) 2(-9,7.735) 3(-9,6.465) 4(-9,5.195) 5(-9,3.925) 6(-9,2.655) 7(-9,1.385) 8(-9,0.115) 9(-9,-1.155) 10(-9,-2.425) 11(-9,-3.695) 12(-9,-4.965) 13(-9,-6.235) 14(-9,-7.505) 25(9,-7.505) 26(9,-6.235) 27(9,-4.965) 28(9,-3.695) 29(9,-2.425) 30(9,-1.155) 31(9,0.115) 32(9,1.385) 33(9,2.655) 34(9,3.925) 35(9,5.195) 36(9,6.465) 37(9,7.735) 38(9,9.005)
  rect 0.9x2 smd: 15(-5.715,-9.005) 16(-4.445,-9.005) 17(-3.175,-9.005) 18(-1.905,-9.005) 19(-0.635,-9.005) 20(0.635,-9.005) 21(1.905,-9.005) 22(3.175,-9.005) 23(4.445,-9.005) 24(5.715,-9.005)
  rect 4.1x4.1 smd: 39(-0.68,1.665)
灯开关
  oval 2x7 hole 1.2x6: 1(0,0) 2(11,0)
  oval 3.6x1.4 hole 3x1: 3(5.5,3.2) 4(5.5,-3.2)
降压模块贴片
  rect 1.626x2.799 smd: 1(-4.826,7.62) 2(-4.791,-6.742) 3(4.283,-6.742) 4(4.283,7.758)

## Nets
As in the schematic.

Pads without a net: CAN0 5; CAN1 5 6; CAN2 5 6; CARD1 9 10 11 12 13; CN2 3 4; CN3 3 4; D0D27 5 6; DC5 3; EN 1 3; FPC2 13 14; RN3 2 3 6 7; RN4 1 2 7 8; RX2TX2 5 6; U1 17 18 19 20 21 22 32 39; U15 4; U20 7 8 9 10 11 12 15; U21 G1 G2; USB1 3 9 13 14

## Via types
v1: diameter 0.61, hole 0.305, Top Layer to Bottom Layer, 105 vias

## Routing (per net, layer and track width the routed paths; a pad name or vN(x,y) marks a point on that pad's centre or on a via; arc(x,y) is an arc through that point)
3.3V: length 240
  Top Layer w0.127: 14.99,46.88 14.95,46.91 14.67,46.91 ; 14.99,46.88 14.71,46.88 14.67,46.91 ; 14.99,46.88 CARD1.4 ; RN2.3 RN2.4 53.3,67.45 v1(53.3,65.91) ; 14.67,46.91 v1(14.6,46.91) ; 14.67,46.91 12.46,49.13 12.46,55.13 ; 5.79,80.05 5.79,81.19 4.59,82.39 4.59,85.73 5.79,86.93 5.79,88.08 ; 12.46,55.13 17.17,55.13 17.17,57.38 10.48,64.06 8.55,64.06 ; 12.46,55.13 RN1.5 RN1.6 RN1.8 ; 43.08,81.32 33.27,81.32 ; 43.08,81.32 43.08,82.2 43.99,83.11 44.24,83.11 ; 43.08,81.32 43.08,80.05 45.29,80.05 47.49,82.25 47.49,84.67 49.74,86.92 U20.16 ; 33.27,81.32 32.64,80.68 U1.2 21.5,80.68 v1(21.02,80.21) ; 33.27,81.32 33.27,98.2 ; 33.27,98.2 FPC2.3 ; 33.27,98.2 FPC2.4 ; C3.2 62.43,61.85 61.47,60.89 61.47,60.76 v1(61.47,60.76) ; 4.59,72.87 5.79,71.67 5.79,70.52 7.76,70.52 8.51,69.77 8.51,64.1 8.55,64.06 ; 8.55,64.06 v1(0.89,64.06) ; CAN0.3 19.58,52.38 18.92,52.38 18.83,52.28 18.83,50.56 19.69,49.71 19.69,49.58 18.67,48.56 v1(18.67,47.3)
  Inner1 w0.127: v1(61.47,60.76) 60.71,61.52 58.29,61.52 53.91,65.91 v1(53.3,65.91) 53.3,65.08 44.77,56.55 3.22,56.55 0.89,58.88 v1(0.89,64.06) ; v1(2.54,79.81) 2.94,80.21 v1(21.02,80.21)
  Inner2 w0.127: v1(2.54,79.81) 0.89,78.16 v1(0.89,64.06)
  Bottom Layer w0.127: v1(18.67,47.3) 14.99,47.3 v1(14.6,46.91)
5V: length 176.3
  Top Layer w0.127: 48.5,58.36 55.81,58.36 58.29,60.84 v1(58.29,63.81) 58.29,64.76 58.1,64.95 ; USB1.2 49.54,91.51 49.54,92.37 v1(49.4,92.51) ; 53.29,86.17 53.29,75.74 52.34,74.79 C4.6 ; 53.29,86.17 64.03,86.17 ; 53.29,86.17 53.29,88.12 55.52,90.35 ; v1(47.12,70.54) 47.12,69.28 ; 61.32,90.35 64.03,87.64 64.03,86.17 ; D0D27.4 59.18,21.9 v1(59.18,31.93) 56.89,31.93 RX2TX2.4 ; 64.03,86.17 64.03,75.35 62.53,73.85 v1(62.53,72.52) ; 47.56,69.28 RN4.6 ; v1(44.91,89.78) 44.91,91.21 USB1.11
  Inner1 w0.127: 58.1,69.04 59.04,69.04 v1(62.53,72.52) ; 58.1,69.04 58.29,68.85 v1(58.29,63.81) ; 58.1,69.04 57.59,69.55 48.1,69.55 v1(47.12,70.54) ; v1(44.91,89.78) 46.67,89.78 v1(49.4,92.51)
  Inner2 w0.127: v1(49.4,92.51) 49.4,92.2 58.29,83.31 v1(58.29,63.81) 59.18,62.92 v1(59.18,31.93)
12V: length 156.7
  Top Layer w1.27: 13.46,19.99 13.46,25.41 15.06,27.01 15.06,28.5 ; DC5.1 DC5.1 13.32,19.82 ; 17.91,96.93 H2.3 v1(17.91,77.04)
  Inner1 w1.27: v1(13.32,35.05) 17.22,35.05 ; 17.22,35.05 17.22,28.71 16.04,27.52 15.06,28.5 ; 17.22,35.05 18.67,36.5 26.55,36.5 CN2.2 46.31,33.37 49.61,30.07 49.61,23.37 46.23,19.99 43.18,19.99 41.23,18.04 CN3.2
  Bottom Layer w1.27: v1(13.32,35.05) 13.32,72.46 v1(17.91,77.04)
GND: length 168.1
  Top Layer w1.27: v1(53.47,43.1) 53.85,42.72 53.85,39.8 55.45,38.2 CAN2.1 ; 开关1.4 8.93,25.49 9.56,26.12 9.56,26.25 12.06,28.75 12.06,31.29 14.22,33.45 16.13,33.45 18.03,31.55 18.03,20.12 14.22,16.31 14.22,8.87 DC5.2 ; v1(56.51,47.93) 56.84,48.25 CAN1.1 56.41,49.96 45.34,49.96 39.42,44.05 39.42,42.65 v1(37.34,40.56)
  Bottom Layer w1.27: v1(37.34,40.56) 31.87,40.56 CN2.1 ; v1(56.51,47.93) 55.37,47.93 55.12,48.18 54.99,48.06 54.99,47.42 53.47,45.9 v1(53.47,43.1) ; CN2.1 18.8,27.49 18.8,23.93 17.4,22.53 10.17,22.53 开关1.4 ; CN2.1 24.68,27.4 24.13,26.85 24.13,24.18 26.8,21.51 34.42,21.51 36.83,19.1 ; 37.08,19.1 37.08,16.18 36.32,15.42 37.85,13.89 46.99,13.89 48.51,15.42 48.51,17.32 48.43,17.4
VCC: length 104.8
  Top Layer w1.27: 56.12,44.2 CAN2.4 56.03,45.01 53.21,45.01 50.42,47.8 v1(48.9,47.8) 48.9,44.25 48.5,43.85 48.5,35.34 v1(47.88,34.72) ; 4.06,28.5 7.24,28.5 9.53,30.78 9.53,34.59 11.68,36.75 19.3,36.75 21.08,34.98 21.08,29.77 22.73,28.12 32.13,28.12 35.43,24.82 v1(36.07,24.82) ; CAN1.4 51.36,56.39 v1(50.55,57.2)
  Bottom Layer w1.27: v1(47.88,34.72) 46.86,33.71 43.31,33.71 43.31,28.75 41.28,26.72 38.1,26.72 36.19,24.82 v1(36.07,24.82) ; v1(48.9,47.8) 50.55,49.45 v1(50.55,57.2)
VIN: length 108.1
  Top Layer w0.127: 62.42,64.95 64.03,66.55 64.03,70.05 U15.2 62.52,71.55 61.03,73.04 61.03,75.1 61.98,76.05 62.93,76.05 62.93,84.56 61.88,85.61 54.96,85.61 53.52,84.18 53.52,74.35 ; 53.52,74.35 C4.5 ; 53.52,74.35 53.73,74.35 v1(54.1,74.73) ; 5.79,90.08 5.79,91.23 3.11,93.9 v1(3.05,93.9)
  Inner1 w0.127: v1(54.1,74.73) 35.99,74.73 16.82,93.9 v1(3.05,93.9)
CAN_H: length 51.4
  Top Layer w0.127: CAN0.7 29.68,54.41 29.79,54.53 R1.2 43.82,54.53 43.91,54.44 43.91,54.37 44,54.28 45.34,54.28 45.43,54.37 45.43,54.44 45.52,54.53 54.83,54.53 54.96,54.39 CAN1.3 59.45,54.39 59.69,54.15 59.69,49.81 59.6,49.72 59.46,49.72 59.37,49.63 59.37,48.29 59.46,48.2 59.6,48.2 59.69,48.11 59.69,46.76 59.6,46.67 59.46,46.67 59.37,46.58 59.37,45.24 59.46,45.15 59.6,45.15 59.69,45.06 59.69,41.33 59.44,41.07 57.97,41.07 CAN2.3
CAN_L: length 51.5
  Top Layer w0.127: CAN0.6 29.68,53.14 29.79,53.02 R1.1 54.86,53.02 54.99,52.88 55.1,52.88 55.59,52.39 CAN1.2 57.02,52.21 58.97,52.21 59.06,52.12 59.06,44.05 59.27,43.83 59.27,43.7 59.18,43.61 59.06,43.61 58.55,43.1 54.99,43.1 54.77,42.89 54.77,40.53 54.86,40.44 56.6,40.44 CAN2.2
CS1: length 33.7
  Top Layer w0.127: U1.29 37.97,70.52 v1(36.12,72.38) ; FPC2.8 31.25,89.65 v1(32,88.9)
  Inner2 w0.127: v1(36.12,72.38) 36.12,84.79 v1(32,88.9)
CS2: length 57.7
  Top Layer w0.127: CARD1.2 9.56,44.67 3.72,50.51 3.72,54.79 7.04,58.11 10.66,58.11 10.76,58.22 v1(11.56,58.22) ; U1.23 36.58,64.07 v1(36.58,65.46)
  Inner1 w0.127: v1(11.56,58.22) 18.8,65.46 v1(36.58,65.46)
D+: length 13.3
  Top Layer w0.127: USB1.6 47.62,91.92 47.12,92.42 46.62,91.92 USB1.8 46.62,83.97 44.5,81.84 U20.5
D-: length 13.9
  Top Layer w0.127: 47.16,90.46 48.12,90.46 USB1.5 ; 47.16,90.46 47.16,83.24 44.5,80.57 U20.6 ; 47.16,90.46 47.12,90.5 USB1.7
EN: length 47.7
  Top Layer w0.127: 44.95,62.79 44.95,63.61 v1(44.91,63.65) ; v1(49.18,75.47) 48.23,76.42 42.61,76.42 42.52,76.33 42.52,76.24 35.81,76.24 32.64,79.41 U1.3 ; RN2.6 52.47,69.06 52.03,68.61 48.92,68.61 v1(48.87,68.66)
  Inner1 w0.127: v1(48.87,68.66) 48.87,67.58 46.38,67.58 44.91,66.11 v1(44.91,63.65)
  Inner2 w0.127: v1(48.87,68.66) 49.18,68.96 v1(49.18,75.47)
G: length 440.1
  Top Layer w0.127: 29.25,98.5 19.58,98.5 19.58,81.95 ; 29.25,98.5 FPC2.12 ; 29.25,98.5 29.25,99.06 32.25,99.06 FPC2.6 FPC2.5 32.75,99.06 34.75,99.06 FPC2.1 42.74,98.2 43.86,97.08 43.86,93.09 ; 43.86,93.09 47.38,93.09 ; 43.86,93.09 43.86,91.4 43.99,91.28 USB1.12 44.17,89.1 ; 17.67,49.08 17.67,56.33 19.56,58.22 28.45,58.22 ; 17.67,49.08 CARD1.6 ; 17.67,49.08 17.67,42.81 25.55,34.93 41.87,34.93 U21.E 46.26,37.49 46.26,25.88 ; 17.67,49.08 17.78,49.08 v1(18.41,49.71) 18.41,53.21 19.61,54.41 CAN0.2 ; RX2TX2.1 46.26,25.88 ; 46.26,25.88 45.93,25.88 ; U21.C 45.26,25.88 45.93,25.88 ; 58.42,91.25 62.72,91.25 64.37,89.6 64.37,64.8 63.8,64.23 61.74,64.23 60.58,65.39 60.58,67.31 U15.1 ; 58.42,91.25 58.42,87.81 ; 58.42,91.25 58.42,92.29 53.52,97.19 50.99,97.19 47.38,93.58 47.38,93.09 ; 47.38,93.09 50.47,93.09 50.93,92.63 50.93,91.63 USB1.1 ; 19.58,74.98 19.04,75.52 19.04,81.42 19.58,81.95 ; 19.58,74.98 18.33,74.98 15.37,77.94 H2.1 15.37,96.93 14.22,98.08 5.54,98.08 5.54,93.45 8.64,90.35 8.64,70.92 8.25,71.3 7.49,71.3 7.49,72.06 5.46,74.09 2.92,74.09 2.92,73.2 2.59,72.87 0.89,74.57 0.89,75.62 1.27,76 1.27,81.07 2.59,82.39 ; 19.58,74.98 26.82,74.98 27.42,74.39 27.42,71.46 ; U1.38 41.26,86.18 44.17,89.1 ; 28.45,58.22 28.45,65.22 27.42,66.25 27.42,71.46 ; 28.45,58.22 43.46,58.22 44.11,58.87 44.11,71.76 45.03,72.68 45.03,72.9 45.38,73.25 47.08,73.25 47.43,72.9 47.43,72.81 ; 47.43,72.81 C4.2 C4.3 C4.4 54.06,72.04 54.06,67.59 56.7,64.95 ; 47.43,72.81 47.43,72.68 ; 19.58,81.95 U1.1 ; v1(23.88,49.96) 24.01,49.83 R2.2 ; 55.52,87.81 58.42,87.81 ; 58.42,87.81 61.32,87.81 ; C3.1 61.03,64.09 60.73,64.39 C1.1 ; D0D27.1 56.79,13.62 v1(56.79,14.59) ; 44.17,89.1 44.17,86.99 U20.1 ; 27.42,71.46 26.54,70.59 U1.15 ; v1(47.71,24.89) 46.91,24.89 45.93,25.88
  Inner2 w0.127: v1(47.71,24.89) 47.71,23.67 v1(56.79,14.59)
  Bottom Layer w0.127: v1(18.41,49.71) 18.67,49.96 v1(23.88,49.96)
IO0: length 159.3
  Top Layer w0.127: RN2.5 53.27,69.06 52.35,68.14 50.28,68.14 50.28,63.95 ; v1(55.94,16.56) 56.84,15.66 D0D27.2 ; 50.28,63.95 50.29,63.93 v1(50.29,63.81) ; 50.28,63.95 50.28,63.18 50.67,62.78 50.67,60.76 50.42,60.5 47.37,60.5 46.61,59.74 46.61,57.2 45.34,57.2 45.34,56.69 v1(45.47,56.57) ; v1(45.34,46.53) 45.34,44.5 42.8,41.96 40.64,41.96 38.26,39.58 36.16,39.58 36.07,39.67 36.07,45.26 34.8,46.53 29.34,46.53 29.21,46.41 19.27,46.41 19.18,46.32 19.18,42.34 20.96,40.56 35.09,40.56 35.18,40.47 35.18,38.88 35.27,38.79 39.88,38.79 U21.D ; v1(41.26,64.45) 41.26,64.45 U1.25
  Inner2 w0.127: v1(50.29,63.81) 55.61,63.81 55.7,63.71 55.7,44.28 55.14,43.72 55.14,17.36 v1(55.94,16.56)
  Bottom Layer w0.127: v1(41.26,64.45) 49.65,64.45 v1(50.29,63.81) ; v1(45.47,56.57) 45.34,56.44 v1(45.34,46.53)
IO2: length 69.1
  Top Layer w0.127: 24.52,81.32 27.43,81.32 32.68,86.56 32.68,96.41 31.75,97.33 FPC2.7 ; 24.52,81.32 20.18,81.32 19.69,80.82 19.69,76.26 26.04,76.26 28.45,73.85 28.45,70.95 33.05,66.34 36.59,66.34 37.97,64.96 U1.24 ; 24.52,81.32 24.52,87.05 20.45,91.13
IO4: length 57.2
  Top Layer w0.127: FPC2.11 29.75,97.58 29.11,96.93 20.54,96.93 ; 20.54,96.93 20.45,96.93 ; 20.54,96.93 v1(20.54,94.03) ; v1(39.34,66.8) 41.17,66.8 U1.26
  Inner2 w0.127: v1(39.34,66.8) 37.49,68.65 25.31,68.65 20.54,73.43 v1(20.54,94.03)
IO12: length 39.3
  Top Layer w0.127: RGB0.1 RGB0.2 RGB0.3 9.14,92.1 9.14,78.43 22.13,65.44 U1.14
IO13: length 57.2
  Top Layer w0.127: v1(56.64,77.01) 56.64,77.67 55.52,78.79 ; 27.81,63.94 27.81,62.04 v1(27.33,61.56)
  Inner1 w0.127: v1(54.99,72.44) 55.25,72.44 56.26,71.42 56.01,71.17 46.23,71.17 45.97,70.92 45.97,68.38 46.55,67.81 48.21,67.81 48.21,69.28 49.45,69.28 49.45,66.02 44.99,61.56 v1(27.33,61.56)
  Bottom Layer w0.127: v1(54.99,72.44) 56.64,74.09 v1(56.64,77.01)
IO14: length 36.9
  Top Layer w0.127: U1.13 24.65,66.71 25.85,67.91 v1(25.85,69.59) ; v1(34.25,97.09) 34.25,98.19
  Inner2 w0.127: v1(34.25,97.09) 25.85,88.69 v1(25.85,69.59)
IO25: length 30.8
  Top Layer w0.127: U1.10 23.81,70.52 25.02,69.31 v1(25.02,68.06) ; v1(23.07,48.88) 23.07,48.87 21.83,47.63 20.7,47.63 20.32,48.01 20.32,51.42 20.34,51.45 CAN0.4
  Inner2 w0.127: v1(23.07,48.88) 23.07,66.11 v1(25.02,68.06)
IO26: length 30.5
  Top Layer w0.127: CAN0.1 21.97,55.68 22.48,55.17 22.48,50.9 21.83,50.26 21.83,50.13 22.06,49.9 v1(22.06,48.88) ; v1(21.72,68.18) 21.72,68.27 22.71,69.25 U1.11
  Inner2 w0.127: v1(22.06,48.88) 21.72,49.22 v1(21.72,68.18)
IO27: length 149.2
  Top Layer w0.127: v1(25.09,59.87) 25.09,65.44 24.44,66.08 21.99,66.08 21.99,67.61 ; U1.12 22.88,67.61 21.99,67.61 ; 21.99,67.61 21.32,67.61 13.45,75.48 13.45,94.21 11.85,95.81 RGB0.5 ; 55.52,81.33 58.36,78.49 58.36,69.65 57.07,68.36 v1(56.72,68.36) ; D0D27.3 56.79,17.62 v1(56.79,18.56)
  Inner1 w0.127: v1(56.72,68.36) 53.39,68.36 51.77,66.75 51.77,64.05 47.6,59.87 v1(25.09,59.87)
  Inner2 w0.127: v1(56.72,68.36) 56.72,64.41 58.48,62.65 58.48,41.37 56.79,39.68 v1(56.79,18.56)
IO32: length 75
  Top Layer w0.127: 61.32,78.79 62.36,77.75 v1(62.36,76.62) ; RGB0.6 12.35,97.31 14.13,95.52 14.13,78.68 19.75,73.06 U1.8 v1(24.89,73.06)
  Inner1 w0.127: v1(24.89,73.06) 25.08,73.25 58.99,73.25 v1(62.36,76.62)
IO33: length 80
  Top Layer w0.127: RGB0.4 10.85,94.31 9.95,95.21 9.95,96.56 12.6,96.56 13.68,95.48 13.68,78.64 20.53,71.79 U1.9 24.6,71.79 26.51,73.71 v1(26.51,74.31) ; v1(61.32,80.06) 61.32,81.33
  Inner1 w0.127: v1(26.51,74.31) 26.91,73.91 55.17,73.91 v1(61.32,80.06)
IO34: length 24.4
  Top Layer w0.127: 4.59,75.69 5.79,76.89 5.79,78.05 ; 4.59,75.69 5.05,75.23 v1(6.48,75.23) ; 4.59,75.69 4.03,76.25 3.15,76.25 2.59,75.69 ; U1.6 23.12,75.74 v1(21.72,75.74)
  Inner1 w0.127: v1(6.48,75.23) 6.98,75.74 v1(21.72,75.74)
IO35: length 28.2
  Top Layer w0.127: U1.7 23.12,74.47 v1(21.72,74.47) ; 5.79,68.52 5.79,67.37 4.59,66.17 ; 4.59,66.17 4.41,66.35 2.77,66.35 2.59,66.17 ; 4.59,66.17 4.75,66.17 v1(5.97,64.95)
  Inner1 w0.127: v1(21.72,74.47) 12.19,64.95 v1(5.97,64.95)
MISO: length 65.9
  Top Layer w0.127: v1(8.63,57.02) 9.14,56.51 10.66,56.51 10.66,49.49 13.82,46.33 16.99,46.33 16.99,48.53 14.85,48.53 14.85,49.53 15.5,50.17 CARD1.7 ; v1(42.52,72.78) 42.23,73.06 U1.31
  Inner1 w0.127: v1(8.63,57.02) 19.08,67.47 38.1,67.47 42.52,71.88 v1(42.52,72.78)
MOSI: length 125.9
  Top Layer w0.127: U1.37 41.14,80.57 v1(39.75,80.57) ; v1(30.25,96.52) FPC2.10 ; CARD1.3 8.96,45.78 3.95,50.78 3.95,54.53 6.91,57.49 10.51,57.49 10.66,57.35 ; 10.66,57.35 v1(11.56,57.35) ; 10.66,57.35 10.66,57.31
  Inner1 w0.127: v1(30.25,96.52) 39.75,87.03 v1(39.75,80.57)
  Inner2 w0.127: v1(11.56,57.35) 12.19,57.98 12.19,86.66 23.56,98.03 34.29,98.03 39.75,92.57 v1(39.75,80.57)
RX2: length 104.1
  Top Layer w0.127: v1(55.96,28.88) 55.96,28.76 RX2TX2.2 ; U1.27 41.81,67.98 43.3,66.49 v1(43.3,59.04) ; 61.32,83.87 58.69,81.24 58.69,68.41 57.42,67.14 v1(57.42,60.94)
  Inner2 w0.127: v1(57.42,60.94) 57.13,60.65 57.13,43.21 55.96,42.05 v1(55.96,28.88)
  Bottom Layer w0.127: v1(43.3,59.04) 43.3,41.54 v1(55.96,28.88)
RXD0: length 12.6
  Top Layer w0.127: v1(39.75,77.27) 40.14,76.87 U1.34 ; U20.2 43.05,85.65 42.93,85.52 v1(42.93,84.12)
  Inner1 w0.127: v1(39.75,77.27) 42.93,80.44 v1(42.93,84.12)
SCL: length 23.2
  Top Layer w0.127: U1.36 41.63,79.78 45.52,79.78 47.82,82.09 47.82,82.46 49.24,83.88 51.82,83.88 52.51,84.58 52.51,89.88 55.52,92.89
SCLK: length 79.4
  Top Layer w0.127: U1.30 38.7,71.79 v1(38.39,72.1) ; FPC2.9 30.75,88.12 v1(32,86.87) ; CARD1.5 15.89,47.94 v1(14.62,47.94)
  Bottom Layer w0.127: v1(32,86.87) 38.39,80.48 v1(38.39,72.1) 38.39,51.52 34.81,47.94 v1(14.62,47.94)
SDA: length 27.4
  Top Layer w0.127: U1.33 41.27,75.62 v1(43.05,75.62) ; v1(60.54,91.78) 60.54,92.1 61.32,92.89
  Inner1 w0.127: v1(43.05,75.62) 44.4,76.96 45.71,76.96 v1(60.54,91.78)
TX2: length 88.6
  Top Layer w0.127: U1.28 40.81,69.7 v1(39.36,69.7) 37.34,67.68 37.34,66.98 39.75,64.57 v1(39.75,64.19) ; 55.52,83.87 55.29,83.64 v1(55.29,82.6) ; v1(53.09,35.61) 53.09,29.88 RX2TX2.3
  Bottom Layer w0.127: v1(39.75,64.19) 39.75,60.76 40.26,60.25 50.8,60.25 51.56,59.49 51.56,37.14 v1(53.09,35.61) ; v1(55.29,82.6) 41.03,82.6 39.12,80.68 39.12,69.94 v1(39.36,69.7)
TXD0: length 12.3
  Top Layer w0.127: v1(45.59,85.65) 45.59,84.76 45.34,84.51 44.37,84.51 U20.3 ; v1(42.67,78.54) 41.65,78.54 U1.35
  Inner2 w0.127: v1(45.59,85.65) 45.59,81.46 v1(42.67,78.54)
VN: length 97.9
  Top Layer w0.127: RN4.3 46.75,66.97 v1(46.33,66.55) ; 43.48,73.7 43.48,72.9 v1(43.64,72.75) ; 43.48,73.7 49.94,73.7 50.59,74.35 ; 43.48,73.7 35.48,73.7 33.89,75.29 33.89,76.87 U1.5 ; U21.A v1(40.26,21.73)
  Inner1 w0.127: v1(46.33,66.55) 46.33,64.1 45.21,62.98 44.6,62.98 43.64,63.94 v1(43.64,72.75)
  Inner2 w0.127: v1(40.26,21.73) 40.94,22.41 44.48,22.41 46.33,24.27 v1(46.33,66.55)
VP: length 97.9
  Top Layer w0.127: v1(44.07,22.98) 44.9,22.98 U21.B ; C4.7 51.54,75.66 v1(50.96,76.25) ; v1(21.75,78.46) 22.94,78.46 U1.4 ; v1(47.56,68.38) 47.56,67.48
  Inner2 w0.127: 47.37,68.56 v1(47.56,68.38) 48.4,69.22 48.4,70.36 ; 48.4,70.36 47.95,69.9 44.81,69.9 43.79,68.88 ; 48.4,70.36 48.4,75.67 48.98,76.25 v1(50.96,76.25) ; v1(21.75,78.46) 21.21,77.93 21.21,73.25 25.58,68.88 43.79,68.88 ; 43.79,68.88 44.1,68.56 44.1,23.02 v1(44.07,22.98)
$1N183: length 42.3
  Top Layer w0.127: v1(10.63,60.33) 10.63,58.91 ; 10.63,58.91 10.66,58.91 ; 10.63,58.91 7.34,58.91 3.49,55.06 3.49,50.25 10.17,43.58 CARD1.1 ; v1(14.62,51.18) 15.82,51.18 CARD1.8
  Inner2 w0.127: v1(10.63,60.33) 10.63,55.17 v1(14.62,51.18)
$1N4998: length 24.1
  Top Layer w0.127: 51.67,64.74 RN2.2 ; 51.67,64.74 52.55,63.87 52.84,63.87 ; 51.67,64.74 51.9,64.74 52.29,65.14 v1(52.29,66.29) ; v1(51.34,79.13) 51.34,82.01 50.24,83.11 49.99,83.11
  Inner2 w0.127: v1(51.34,79.13) 52.29,78.18 v1(52.29,66.29)
$1N5002: length 11.9
  Top Layer w0.127: 47.25,61.84 47.28,61.84 48.15,62.71 48.15,68.91 49.08,69.84 51.67,69.84 RN2.7
$1N5022: length 30.7
  Top Layer w0.127: 47.25,63.74 v1(47.25,62.79) ; RN2.1 50.97,67.37 v1(50.97,66.29) ; v1(51.66,84.7) 50.31,84.7 U20.14
  Inner1 w0.127: v1(47.25,62.79) 50.75,66.29 v1(50.97,66.29)
  Inner2 w0.127: v1(51.66,84.7) 52.8,83.56 52.8,65.72 51.55,65.72 v1(50.97,66.29)
$1N5027: length 9.4
  Top Layer w0.127: 52.84,61.97 51.12,63.68 v1(51.12,64.95) ; RN2.8 50.31,69.28 v1(50.11,69.08)
  Inner1 w0.127: v1(51.12,64.95) 51.55,65.37 51.55,67.65 v1(50.11,69.08)
$1N5307: length 20
  Top Layer w0.127: v1(45.59,92.51) 45.62,92.48 USB1.10 ; v1(47.13,75.85) 47.13,74.78 47.43,74.48
  Inner2 w0.127: v1(47.13,75.85) 47.13,90.97 v1(45.59,92.51)
$1N5334: length 20.6
  Top Layer w0.127: v1(49.08,90) 48.62,90.46 USB1.4 ; v1(45.03,75.62) 45.03,74.48
  Inner2 w0.127: v1(45.03,75.62) 45.37,75.28 47.54,75.28 48.07,75.81 48.07,88.99 v1(49.08,90)
$1N9575: length 14.5
  Top Layer w0.127: R2.1 25.65,48.32 v1(25.4,48.56) ; v1(24,55.42) 24.48,55.42 24.74,55.68 CAN0.8
  Bottom Layer w0.127: v1(25.4,48.56) 25.4,50.09 24,51.49 v1(24,55.42)

## Copper pours and planes (outline as drawn; the poured copper is in the pictures)
12V on Bottom Layer: -70.61,180.39 95.25,180.39 95.25,-14.55 -70.61,-14.55
GND on Top Layer: -55.25,115.24 84.96,115.24 84.96,-55.45 -55.25,-55.45
VCC on Inner1: -14.86,103.56 151.51,103.56 151.51,-70.05 -14.86,-70.05
VCC on Inner2: -16.26,154.61 140.84,154.61 140.84,-30.18 -16.26,-30.18

## Text on the board
Bottom Silkscreen Layer: v1.0 | 2024/9/25 | 使用教程 | 设计者： / 行走的IP / （B站） | 灵肱机械人 / 主控板
Top Silkscreen Layer: 0.1uF | GND VCC PWM | GND 5V PWM | IO13 IO27 IO17 | IO32 IO33 IO16 | 10k | 5.1k | 22uF | D32D33 | D22D21 | v1.0 | 2024/10/14 | 设计者： / 行走的IP / （B站） | 灵肱机械人 / 主控板 | GND L H VCC | GND RX TX 5V | GND 0 27 5V
